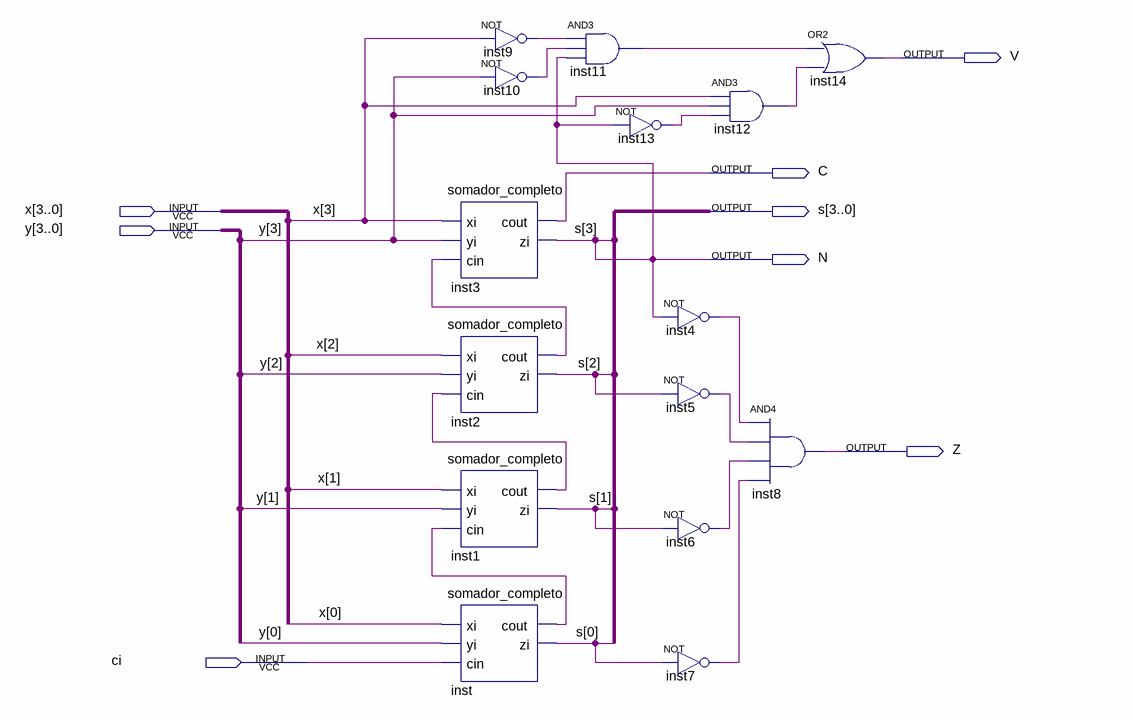
[diagram p0: schematic sheet]
// Quartus schematic somador_4_bits.bdf as structural Verilog: 15 symbols, 8 pins
module somador_4_bits (
  input  [3:0] x,
  input  [3:0] y,
  input  ci,
  output V,
  output C,
  output [3:0] s,
  output N,
  output Z
);

  wire inst1_cout, inst2_cout, inst4_out, inst5_out, inst6_out, inst7_out, inst9_out, inst10_out, inst11_out,
       inst12_out, inst13_out, inst_cout;

  somador_completo inst3 (.xi(x[3]), .yi(y[3]), .cin(inst2_cout), .cout(C), .zi(N));
  somador_completo inst2 (.xi(x[2]), .yi(y[2]), .cin(inst1_cout), .cout(inst2_cout), .zi(s[2]));
  somador_completo inst1 (.xi(x[1]), .yi(y[1]), .cin(inst_cout), .cout(inst1_cout), .zi(s[1]));
  somador_completo inst (.xi(x[0]), .yi(y[0]), .cin(ci), .cout(inst_cout), .zi(s[0]));
  not inst9 (inst9_out, x[3]);
  not inst10 (inst10_out, y[3]);
  and inst11 (inst11_out, inst9_out, inst10_out, N);
  not inst13 (inst13_out, N);
  not inst4 (inst4_out, N);
  not inst5 (inst5_out, s[2]);
  not inst6 (inst6_out, s[1]);
  not inst7 (inst7_out, s[0]);
  and inst12 (inst12_out, x[3], y[3], inst13_out);
  and inst8 (Z, inst4_out, inst5_out, inst6_out, inst7_out);
  or inst14 (V, inst11_out, inst12_out);

  assign s[3] = N;
endmodule
